# Altium schematic sheet Power.SchDoc
size A4; SheetNumber: 3; SheetTotal: 4
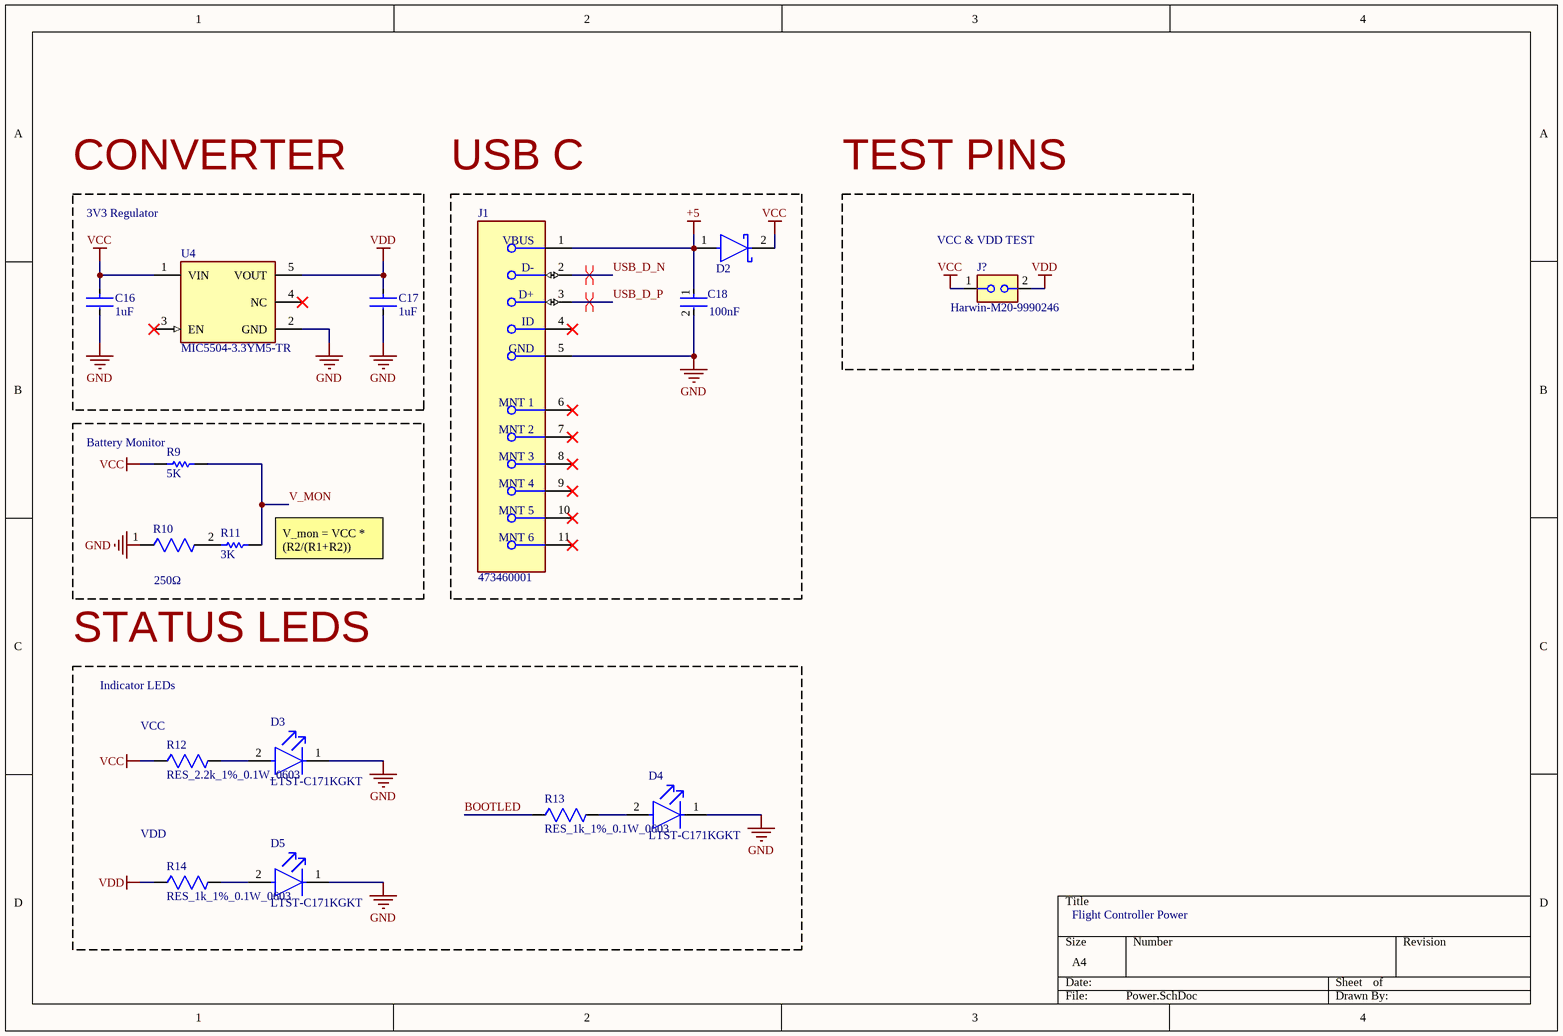
[diagram p0: Power.SchDoc]

## Parts
C16  1uF  [CAP_0603]
C17  1uF  [CAP_0603]
C18  100nF  [FP-CL93-IPC_C]
D2  SCHOTTKY_40Vrm_1A_500mV  [FP-403AE-MFG]  (value not drawn)
D3  LTST-C171KGKT  [FP-LTST-C171KGKT-MFG]
D4  LTST-C171KGKT  [FP-LTST-C171KGKT-MFG]
D5  LTST-C171KGKT  [FP-LTST-C171KGKT-MFG]
J1  473460001  [FP-473460001-MFG]
J?  Harwin-M20-9990246  [HARWIN_M20-9990246]
R9  5K  [RESC2013X83X38NL15T13]
R10  (no value)  [RNCF0603_MFG]
R11  3K  [RESC3116X65X40ML10T20]
R12  RES_2.2k_1%_0.1W_0603  [RES_0603]
R13  RES_1k_1%_0.1W_0603  [RES_0603]
R14  RES_1k_1%_0.1W_0603  [RES_0603]
U4  MIC5504-3.3YM5-TR  [FP-SOT23-5LD-PL-1-MFG]

## Blocks framed on the sheet
CONVERTER: C16 C17 U4
USB C: C18 D2 J1
TEST PINS: J?
Battery Monitor: R9-R11
STATUS LEDS: D3-D5 R12-R14

## Nets
+5: C18.1 D2.1(A) J1.1(VBUS)
GND: C16.2 C17.2 C18.2 D3.1(C) D4.1(C) D5.1(C) J1.5(GND) R10.1 U4.2(GND)
VCC: C16.1 D2.2(C) J?.1 R9.1 R12.1 U4.1(VIN)
VDD: C17.1 J?.2 R14.1 U4.5(VOUT)
BOOTLED: R13.1
USB_D_N: J1.2(D-)
USB_D_P: J1.3(D+)
V_MON: R9.2 R11.2
NetD3_2: D3.2(A) R12.2
NetD4_2: D4.2(A) R13.2
NetD5_2: D5.2(A) R14.2
NetR10_2: R10.2 R11.1

Not connected (* = marked no-connect by the designer): J1 4(ID)* 6(MNT_1)* 7(MNT_2)* 8(MNT_3)* 9(MNT_4)* 10(MNT_5)* 11(MNT_6)*; U4 3(EN)* 4(NC)*

## Layout directives
differential pair: USB_D_N, USB_D_P

## Notes on the sheet
- 3V3 Regulator
- (near J?) VCC & VDD TEST
- (near R11) V_mon = VCC * (R2/(R1+R2))
- Indicator LEDs
- (near R12) VCC
- (near R14) VDD
- Flight Controller Power

## Library data of the parts
C16 C17 = CMP-097-000006-8: CAP CER 1UF 50V X5R 0603; Tolerance  (fill in as +-): 10%; Multilayer: Yes; Dielectric Material: Ceramic; Mounting Technology: Surface Mount; Max Operating Temperature: 85°C; Value: 1uF; Package Style: SMTMeter; Termination: Wraparound; JESD-609 Code: e3; Temperature Characteristics Code: X5R; Rated DC Voltage (URdc): 50V; Packaging: Tape and Reel; Tolerance (fill in as +-): 10%; Case/Package: 0603; JLCPCB Part No.: C15849; Height: 0.9mm; Package Shape: Rectangular; Terminal Finish: Nickel; Capacitor Type: Ceramic; Reach SVHC Compliant: Yes; Width: 0.8mm; Length: 1.6mm; Min Operating Temperature: -55°C; Pins: 2; RoHS Compliant: Yes
C18 = CMP-13271-000610-1: Cap Ceramic 100nF 10V X7R ±10% SMD 0402 +125°C Paper T/R
D2 = CMP-00074-2: SS14 Series 500 mV 1 A 40 V Max Reverse Voltage Schottky Rectifier - DO-214AC; JLCPCB Part No.: C2480
D3-D5 = CMP-22017-000037-1: LED GREEN CLEAR SMD; Number of LEDs: 1; Viewing Angle: 130°; Lens Style: Rectangular; Dominant Wavelength: 571nm; Test Current: 20mA; Luminous Intensity: 35mcd; Power Rating: 75mW; Forward Voltage: 2.4V; Forward Current: 30mA; Reverse Voltage: 5V; Lens Color: Colorless; Wavelength: 574nm; Height: 0.8mm; Illumination Color: Green; Length: 2mm; Case/Package: 0805; Number of Pins: 2; Number of Elements: 1; Package Quantity: 1; Depth: 1.25mm; Lens Transparency: Clear; Width: 1.25mm; Color: Green; Radiation Hardening: No; Mount: Surface Mount; Packaging: Tape and Reel; Case Code (Metric): 2012; Lead Free: Lead Free; Max Operating Temperature: 85°C; Min Operating Temperature: -55°C; Case Code (Imperial): 0805; Power Dissipation: 75mW
J1 = CMP-2000-05246-2: CONN RCPT USB2.0 MICRO B SMD R/A; Manufacturer: Molex; Conn Orientation: Right Angle; Is Female: yes; Shielding: true; Pitch: 0.65mm; Number Of Contacts: 5; Voltage Rating: 30V; Current Rating: 1.8A; Device Class L2: USB Connectors; Digikey Description: CONN RCPT USB2.0 MICRO B SMD R/A; Height: 2.945mm; RoHS: TRUE; ComponentLink2Description: Datasheet; Octopart: https://octopart.com/47346-0001-molex-7164928; Automotive: No; Package: 0; Category: Conn; Device Class L1: Connectors; Usb Standard: USB 2.0; Temperature: -30°C to +85°C; Temperature Range Low: -30°C; Footprint Url: https://www.molex.com/pdm_docs/sd/473460001_sd.pdf; ComponentLink2URL: https://www.molex.com/webdocs/datasheets/pdf/en-us/0473460001_IO_CONNECTORS.pdf; Lead Free: Yes; Manufacturer Part Number: 473460001; Contact Material: Gold,Nickel; Temperature Range High: +85°C; Device Class L3: unset
J? = CMP-00000-10: Connector Header Through Hole 2 position 0.100" (2.54mm); Number of Positions: 2; Contact Resistance: 30mR; Voltage Rating (AC): 750V; Max Current Rating: 3A; Insulation Resistance: 10GR; Gender: Male; Case/Package: SIL; Termination: Solder; Mount: Through Hole; Housing Material: Nylon; Max Operating Temperature: 105°C; JLCPCB Part No.: C3332353; Orientation: Straight; Contact Material: Bronze,Brass; Depth: 2.54mm; Current Rating: 3A; Radiation Hardening: No; Pitch: 2.54mm; Reach SVHC Compliant: No; Length: 5.08mm; Number of Rows: 1; Series: M20; Packaging: Bulk; Contact Plating: Tin; Contact Type: Male Pin; Color: Black; Contact Mating Length: 0.24inch; Package Quantity: 1000; Housing Color: Black; Min Operating Temperature: -40°C; Number of Contacts: 2
R9 = CMP-2001-04320-1: Manufacturer: Vishay Dale; Part Number: PNM0805E5001BST5
R10 = CMP-00347-47553138-1: Res Thin Film 0603 250 Ohm 0.01% 0.1W(1/10W) ±5ppm/°C Pad SMD T/R Automotive AEC-Q200; Power Rating: 63mW; Max Power Dissipation: 100mW; Resistance: 250Ω; Schedule B: 8533210045, 8533210045; Features: Moisture Resistant; Case Code (Imperial): 0603; Width: 787.4µm; Case/Package: 0603; Composition: Thin Film; ComponentLink2Description: Datasheet URL; HelpURL: https://www.seielect.com/catalog/sei-rncf.pdf; Number of Terminations: 2; Length: 1.6002mm; ComponentLink1Description: Manufacturer's Website; Temperature Coefficient: 5ppm/°C; Mount: Surface Mount; Tolerance: 0.01%; Case Code (Metric): 1608; Max Operating Temperature: 155°C; RoHS: Compliant; Height: 558.8µm; ComponentLink2URL: https://www.seielect.com/catalog/sei-rncf.pdf; Min Operating Temperature: -55°C; ComponentLink1URL: http://www.seielect.com
R11 = CMP-2003-03976-1: Part Number: RC1206JR-073KL; Manufacturer: Yageo
R12 = CMP-027-000005-7: 2.2 kOhms ±1% 0.1W, 1/10W Chip Resistor 0603 (1608 Metric) Moisture Resistant Thick Film; Value: 2.2kR; JLCPCB Part No.: C114662
R13 R14 = CMP-019-000000-15: 1 kOhms ±1% 0.1W, 1/10W Chip Resistor 0603 (1608 Metric) Moisture Resistant Thick Film; Rated Temperature: 70°C; Working Voltage: 75V; Package Height: 0.45mm; MP: RC0805FR-071KL; Package Length: 1.6mm; Additional Feature: LASER TRIMMABLE; Temperature Coefficient: 100ppm/°C; Power: 100mW; MF: Yageo; Value: 1kR; Package Width: 0.8mm; Availability: In Stock; Package Style: SMTMeter; Termination: Wraparound; Min Operating Temperature: -55°C; SnapEDA_Link: https://www.snapeda.com/parts/RC0805FR-071KL/Yageo/view-part/?ref=snap; Mounting Technology: Surface Mount; Package: 2012 Rohm Semiconductor; JESD-609 Code: e3; Resistor Type: FIXED RESISTOR; Tolerance: 1%; RoHS Compliant: Yes; Case/Package: 0603; Package Shape: Rectangular; Component Type: Standard; Check_prices: https://www.snapeda.com/parts/RC0805FR-071KL/Yageo/view-part/?ref=eda; Pins: 2; Source: RC0805FR-071KL.SchLib; JLCPCB Part No.: C22548; Max Operating Temperature: 155°C; Pin Count: 2; Construction: Chip; Purchase-URL: https://pricing.snapeda.com/search/part/RC0805FR-071KL/?ref=eda; Terminal Finish: Nickel; Technology: METAL GLAZE/THICK FILM; Price: None; Reach SVHC Compliant: Yes; Design Item ID: RC0805FR-071KL; Packaging: Tape and Reel
U4 = CMP-2000-07604-2: IC REG LINEAR 3.3V 300MA SOT23-5; Quiescent Current: 38uA; Operating Supply Current: 42uA; Max Input Voltage: 5.5V; Min Input Voltage: 2.5V; Output Type: Fixed; Power Supply Rejection Ratio (PSRR): 60dB; Dropout Voltage: 380mV; Accuracy: 3%; Number of Outputs: 1; Nominal Output Voltage: 3.3V; Max Output Current: 300mA; Length: 2.9mm; Mount: Surface Mount; Width: 1.6mm; Packaging: Tape and Reel; Output Current: 300mA; Min Operating Temperature: -40°C; Max Operating Temperature: 125°C; Height: 1.1mm; Case/Package: SOT-23-5; REACH SVHC: No SVHC; Number of Pins: 5; Output Voltage: 3.3V